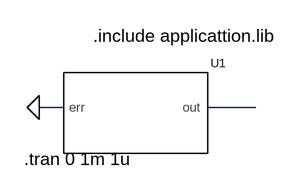
[diagram p0: schematic test.asc]
test.asc, the LTspice schematic file:
Version 4
SHEET 1 880 680
WIRE 80 144 48 144
WIRE 336 144 272 144
FLAG 48 144 0
SYMBOL POWERVCO 160 160 R0
SYMATTR SpiceLine Fmin=95k Fmax=110k Vout=350
SYMATTR InstName U1
TEXT 120 48 Left 0 !.include applicattion.lib
TEXT 28 212 Left 0 !.tran 0 1m 1u

The netlist it stands for:
* test.asc
XU1 0 N001 POWERVCO Fmin=95k Fmax=110k Vout=350  ; pins err out
.include applicattion.lib
.tran 0 1m 1u
.backanno
.end